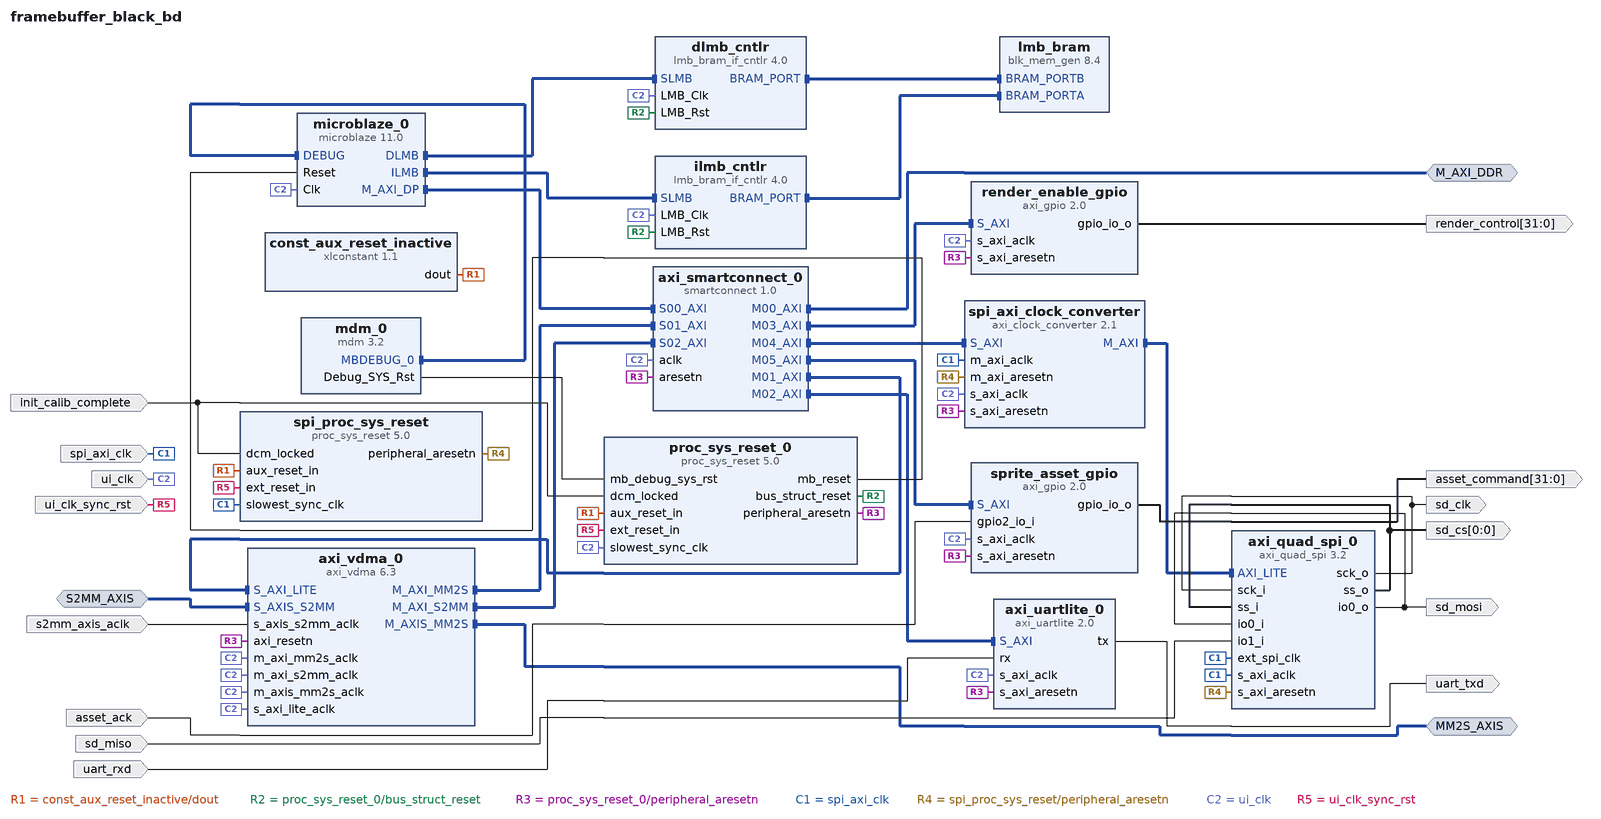
[diagram p0: block diagram of the top level]
# Vivado block design framebuffer_black_bd, xc7a100tfgg484-2, Vivado 2025.2
create_bd_design framebuffer_black_bd

create_bd_intf_port -mode Master -vlnv xilinx.com:interface:aximm_rtl:1.0 M_AXI_DDR
set_property -dict [list \
  CONFIG.ADDR_WIDTH 32 \
  CONFIG.DATA_WIDTH 256 \
  CONFIG.NUM_READ_OUTSTANDING 8 \
  CONFIG.NUM_WRITE_OUTSTANDING 8 \
  CONFIG.PROTOCOL AXI4 \
] [get_bd_intf_ports M_AXI_DDR]
create_bd_intf_port -mode Master -vlnv xilinx.com:interface:axis_rtl:1.0 MM2S_AXIS
create_bd_intf_port -mode Slave -vlnv xilinx.com:interface:axis_rtl:1.0 S2MM_AXIS
set_property -dict [list \
  CONFIG.FREQ_HZ 74250000 \
  CONFIG.HAS_TKEEP 1 \
  CONFIG.HAS_TLAST 1 \
  CONFIG.HAS_TREADY 1 \
  CONFIG.HAS_TSTRB 0 \
  CONFIG.LAYERED_METADATA undef \
  CONFIG.TDATA_NUM_BYTES 2 \
  CONFIG.TDEST_WIDTH 0 \
  CONFIG.TID_WIDTH 0 \
  CONFIG.TUSER_WIDTH 1 \
] [get_bd_intf_ports S2MM_AXIS]
create_bd_port -dir I -type clk ui_clk
set_property -dict {CONFIG.FREQ_HZ 100000000} [get_bd_ports ui_clk]
create_bd_port -dir I -type clk spi_axi_clk
set_property -dict {CONFIG.FREQ_HZ 6250000} [get_bd_ports spi_axi_clk]
create_bd_port -dir I -type rst ui_clk_sync_rst
set_property -dict {CONFIG.POLARITY ACTIVE_HIGH} [get_bd_ports ui_clk_sync_rst]
create_bd_port -dir I init_calib_complete
create_bd_port -dir I -type clk s2mm_axis_aclk
set_property -dict {CONFIG.ASSOCIATED_BUSIF S2MM_AXIS CONFIG.FREQ_HZ 74250000} [get_bd_ports s2mm_axis_aclk]
create_bd_port -dir I uart_rxd
create_bd_port -dir O uart_txd
create_bd_port -dir I sd_miso
create_bd_port -dir O sd_mosi
create_bd_port -dir O sd_clk
create_bd_port -dir O -from 0 -to 0 sd_cs
create_bd_port -dir O -from 31 -to 0 render_control
create_bd_port -dir O -from 31 -to 0 asset_command
create_bd_port -dir I asset_ack

create_bd_cell -type ip -vlnv xilinx.com:ip:microblaze:11.0 microblaze_0
set_property -dict [list \
  CONFIG.C_AREA_OPTIMIZED 1 \
  CONFIG.C_DEBUG_ENABLED 1 \
  CONFIG.C_D_AXI 1 \
  CONFIG.C_D_LMB 1 \
  CONFIG.C_I_LMB 1 \
  CONFIG.C_USE_BARREL 1 \
  CONFIG.C_USE_HW_MUL 1 \
] [get_bd_cells microblaze_0]
create_bd_cell -type ip -vlnv xilinx.com:ip:lmb_bram_if_cntlr:4.0 ilmb_cntlr
create_bd_cell -type ip -vlnv xilinx.com:ip:lmb_bram_if_cntlr:4.0 dlmb_cntlr
create_bd_cell -type ip -vlnv xilinx.com:ip:blk_mem_gen:8.4 lmb_bram
set_property -dict [list \
  CONFIG.Enable_B Use_ENB_Pin \
  CONFIG.Memory_Type True_Dual_Port_RAM \
  CONFIG.Read_Width_A 32 \
  CONFIG.Read_Width_B 32 \
  CONFIG.Use_RSTA_Pin true \
  CONFIG.Use_RSTB_Pin true \
  CONFIG.Write_Width_A 32 \
  CONFIG.Write_Width_B 32 \
] [get_bd_cells lmb_bram]
create_bd_cell -type ip -vlnv xilinx.com:ip:mdm:3.2 mdm_0
set_property -dict {CONFIG.C_USE_UART 0} [get_bd_cells mdm_0]
create_bd_cell -type ip -vlnv xilinx.com:ip:proc_sys_reset:5.0 proc_sys_reset_0
create_bd_cell -type ip -vlnv xilinx.com:ip:xlconstant:1.1 const_aux_reset_inactive
set_property -dict {CONFIG.CONST_VAL 1} [get_bd_cells const_aux_reset_inactive]
create_bd_cell -type ip -vlnv xilinx.com:ip:axi_vdma:6.3 axi_vdma_0
set_property -dict [list \
  CONFIG.c_flush_on_fsync 0 \
  CONFIG.c_include_internal_genlock 1 \
  CONFIG.c_include_mm2s 1 \
  CONFIG.c_include_mm2s_dre 1 \
  CONFIG.c_include_s2mm 1 \
  CONFIG.c_include_s2mm_dre 1 \
  CONFIG.c_m_axi_mm2s_data_width 64 \
  CONFIG.c_m_axi_s2mm_data_width 64 \
  CONFIG.c_m_axis_mm2s_tdata_width 16 \
  CONFIG.c_mm2s_genlock_mode 3 \
  CONFIG.c_mm2s_linebuffer_depth 4096 \
  CONFIG.c_mm2s_max_burst_length 16 \
  CONFIG.c_num_fstores 3 \
  CONFIG.c_s2mm_genlock_mode 2 \
  CONFIG.c_s2mm_linebuffer_depth 4096 \
  CONFIG.c_s2mm_max_burst_length 16 \
  CONFIG.c_use_mm2s_fsync 0 \
  CONFIG.c_use_s2mm_fsync 0 \
] [get_bd_cells axi_vdma_0]
create_bd_cell -type ip -vlnv xilinx.com:ip:axi_uartlite:2.0 axi_uartlite_0
set_property -dict {CONFIG.C_BAUDRATE 115200 CONFIG.C_DATA_BITS 8 CONFIG.C_USE_PARITY 0} [get_bd_cells axi_uartlite_0]
create_bd_cell -type ip -vlnv xilinx.com:ip:axi_quad_spi:3.2 axi_quad_spi_0
set_property -dict [list \
  CONFIG.C_FIFO_DEPTH 16 \
  CONFIG.C_NUM_SS_BITS 1 \
  CONFIG.C_NUM_TRANSFER_BITS 8 \
  CONFIG.C_SCK_RATIO 16 \
  CONFIG.C_SPI_MODE 0 \
  CONFIG.C_TYPE_OF_AXI4_INTERFACE 0 \
  CONFIG.C_USE_STARTUP 0 \
  CONFIG.Master_mode 1 \
] [get_bd_cells axi_quad_spi_0]
create_bd_cell -type ip -vlnv xilinx.com:ip:axi_clock_converter:2.1 spi_axi_clock_converter
create_bd_cell -type ip -vlnv xilinx.com:ip:proc_sys_reset:5.0 spi_proc_sys_reset
create_bd_cell -type ip -vlnv xilinx.com:ip:axi_gpio:2.0 render_enable_gpio
set_property -dict [list \
  CONFIG.C_ALL_OUTPUTS 1 \
  CONFIG.C_DOUT_DEFAULT 0x00000000 \
  CONFIG.C_GPIO_WIDTH 32 \
] [get_bd_cells render_enable_gpio]
create_bd_cell -type ip -vlnv xilinx.com:ip:axi_gpio:2.0 sprite_asset_gpio
set_property -dict [list \
  CONFIG.C_ALL_INPUTS_2 1 \
  CONFIG.C_ALL_OUTPUTS 1 \
  CONFIG.C_DOUT_DEFAULT 0x00000000 \
  CONFIG.C_GPIO2_WIDTH 1 \
  CONFIG.C_GPIO_WIDTH 32 \
  CONFIG.C_IS_DUAL 1 \
] [get_bd_cells sprite_asset_gpio]
create_bd_cell -type ip -vlnv xilinx.com:ip:smartconnect:1.0 axi_smartconnect_0
set_property -dict {CONFIG.NUM_MI 6 CONFIG.NUM_SI 3} [get_bd_cells axi_smartconnect_0]

# ---- connections ----

connect_bd_intf_net [get_bd_intf_ports S2MM_AXIS] [get_bd_intf_pins axi_vdma_0/S_AXIS_S2MM]
connect_bd_intf_net [get_bd_intf_pins axi_smartconnect_0/M00_AXI] [get_bd_intf_ports M_AXI_DDR]
connect_bd_intf_net [get_bd_intf_pins axi_smartconnect_0/M01_AXI] [get_bd_intf_pins axi_vdma_0/S_AXI_LITE]
connect_bd_intf_net [get_bd_intf_pins axi_smartconnect_0/M02_AXI] [get_bd_intf_pins axi_uartlite_0/S_AXI]
connect_bd_intf_net [get_bd_intf_pins axi_smartconnect_0/M03_AXI] [get_bd_intf_pins render_enable_gpio/S_AXI]
connect_bd_intf_net [get_bd_intf_pins axi_smartconnect_0/M04_AXI] [get_bd_intf_pins spi_axi_clock_converter/S_AXI]
connect_bd_intf_net [get_bd_intf_pins axi_smartconnect_0/M05_AXI] [get_bd_intf_pins sprite_asset_gpio/S_AXI]
connect_bd_intf_net [get_bd_intf_pins axi_vdma_0/M_AXIS_MM2S] [get_bd_intf_ports MM2S_AXIS]
connect_bd_intf_net [get_bd_intf_pins axi_vdma_0/M_AXI_MM2S] [get_bd_intf_pins axi_smartconnect_0/S01_AXI]
connect_bd_intf_net [get_bd_intf_pins axi_vdma_0/M_AXI_S2MM] [get_bd_intf_pins axi_smartconnect_0/S02_AXI]
connect_bd_intf_net [get_bd_intf_pins dlmb_cntlr/BRAM_PORT] [get_bd_intf_pins lmb_bram/BRAM_PORTB]
connect_bd_intf_net [get_bd_intf_pins ilmb_cntlr/BRAM_PORT] [get_bd_intf_pins lmb_bram/BRAM_PORTA]
connect_bd_intf_net [get_bd_intf_pins microblaze_0/DEBUG] [get_bd_intf_pins mdm_0/MBDEBUG_0]
connect_bd_intf_net [get_bd_intf_pins microblaze_0/DLMB] [get_bd_intf_pins dlmb_cntlr/SLMB]
connect_bd_intf_net [get_bd_intf_pins microblaze_0/ILMB] [get_bd_intf_pins ilmb_cntlr/SLMB]
connect_bd_intf_net [get_bd_intf_pins microblaze_0/M_AXI_DP] [get_bd_intf_pins axi_smartconnect_0/S00_AXI]
connect_bd_intf_net [get_bd_intf_pins spi_axi_clock_converter/M_AXI] [get_bd_intf_pins axi_quad_spi_0/AXI_LITE]
connect_bd_net [get_bd_ports asset_ack] [get_bd_pins sprite_asset_gpio/gpio2_io_i]
connect_bd_net [get_bd_pins axi_quad_spi_0/io0_o] [get_bd_ports sd_mosi] [get_bd_pins axi_quad_spi_0/io0_i]
connect_bd_net [get_bd_pins axi_quad_spi_0/sck_o] [get_bd_ports sd_clk] [get_bd_pins axi_quad_spi_0/sck_i]
connect_bd_net [get_bd_pins axi_quad_spi_0/ss_o] [get_bd_ports sd_cs] [get_bd_pins axi_quad_spi_0/ss_i]
connect_bd_net [get_bd_pins axi_uartlite_0/tx] [get_bd_ports uart_txd]
connect_bd_net [get_bd_pins const_aux_reset_inactive/dout] [get_bd_pins proc_sys_reset_0/aux_reset_in] [get_bd_pins spi_proc_sys_reset/aux_reset_in]
connect_bd_net [get_bd_ports init_calib_complete] [get_bd_pins proc_sys_reset_0/dcm_locked] [get_bd_pins spi_proc_sys_reset/dcm_locked]
connect_bd_net [get_bd_pins mdm_0/Debug_SYS_Rst] [get_bd_pins proc_sys_reset_0/mb_debug_sys_rst]
connect_bd_net [get_bd_pins proc_sys_reset_0/bus_struct_reset] [get_bd_pins ilmb_cntlr/LMB_Rst] [get_bd_pins dlmb_cntlr/LMB_Rst]
connect_bd_net [get_bd_pins proc_sys_reset_0/mb_reset] [get_bd_pins microblaze_0/Reset]
connect_bd_net [get_bd_pins proc_sys_reset_0/peripheral_aresetn] \
  [get_bd_pins axi_vdma_0/axi_resetn] [get_bd_pins axi_uartlite_0/s_axi_aresetn] \
  [get_bd_pins render_enable_gpio/s_axi_aresetn] [get_bd_pins sprite_asset_gpio/s_axi_aresetn] \
  [get_bd_pins spi_axi_clock_converter/s_axi_aresetn] [get_bd_pins axi_smartconnect_0/aresetn]
connect_bd_net [get_bd_pins render_enable_gpio/gpio_io_o] [get_bd_ports render_control]
connect_bd_net [get_bd_ports s2mm_axis_aclk] [get_bd_pins axi_vdma_0/s_axis_s2mm_aclk]
connect_bd_net [get_bd_ports sd_miso] [get_bd_pins axi_quad_spi_0/io1_i]
connect_bd_net [get_bd_ports spi_axi_clk] \
  [get_bd_pins spi_proc_sys_reset/slowest_sync_clk] [get_bd_pins axi_quad_spi_0/s_axi_aclk] \
  [get_bd_pins axi_quad_spi_0/ext_spi_clk] [get_bd_pins spi_axi_clock_converter/m_axi_aclk]
connect_bd_net [get_bd_pins spi_proc_sys_reset/peripheral_aresetn] \
  [get_bd_pins axi_quad_spi_0/s_axi_aresetn] [get_bd_pins spi_axi_clock_converter/m_axi_aresetn]
connect_bd_net [get_bd_pins sprite_asset_gpio/gpio_io_o] [get_bd_ports asset_command]
connect_bd_net [get_bd_ports uart_rxd] [get_bd_pins axi_uartlite_0/rx]
connect_bd_net [get_bd_ports ui_clk] \
  [get_bd_pins proc_sys_reset_0/slowest_sync_clk] [get_bd_pins microblaze_0/Clk] [get_bd_pins ilmb_cntlr/LMB_Clk] \
  [get_bd_pins dlmb_cntlr/LMB_Clk] [get_bd_pins axi_vdma_0/s_axi_lite_aclk] [get_bd_pins axi_vdma_0/m_axi_mm2s_aclk] \
  [get_bd_pins axi_vdma_0/m_axis_mm2s_aclk] [get_bd_pins axi_vdma_0/m_axi_s2mm_aclk] [get_bd_pins axi_uartlite_0/s_axi_aclk] \
  [get_bd_pins render_enable_gpio/s_axi_aclk] [get_bd_pins sprite_asset_gpio/s_axi_aclk] \
  [get_bd_pins axi_smartconnect_0/aclk] [get_bd_pins spi_axi_clock_converter/s_axi_aclk]
connect_bd_net [get_bd_ports ui_clk_sync_rst] [get_bd_pins proc_sys_reset_0/ext_reset_in] [get_bd_pins spi_proc_sys_reset/ext_reset_in]
set_property HDL_ATTRIBUTE.BMM_INFO_PROCESSOR {microblaze-le > framebuffer_black_bd dlmb_cntlr} [get_bd_cells microblaze_0]
set_property HDL_ATTRIBUTE.KEEP_HIERARCHY yes [get_bd_cells microblaze_0]
set_property HDL_ATTRIBUTE.BMM_INFO_ADDRESS_SPACE {byte  0x00000000 32 > framebuffer_black_bd lmb_bram} [get_bd_cells dlmb_cntlr]
set_property HDL_ATTRIBUTE.KEEP_HIERARCHY yes [get_bd_cells dlmb_cntlr]

# ---- address map ----
assign_bd_address -offset 0x80000000 -range 512M -target_address_space [get_bd_addr_spaces axi_vdma_0/Data_MM2S] [get_bd_addr_segs M_AXI_DDR/Reg]
exclude_bd_addr_seg -offset 0x00000000 -range 1 -target_address_space [get_bd_addr_spaces axi_vdma_0/Data_MM2S] [get_bd_addr_segs axi_quad_spi_0/AXI_LITE/Reg]
exclude_bd_addr_seg -offset 0x00000000 -range 1 -target_address_space [get_bd_addr_spaces axi_vdma_0/Data_MM2S] [get_bd_addr_segs axi_uartlite_0/S_AXI/Reg]
exclude_bd_addr_seg -offset 0x00000000 -range 1 -target_address_space [get_bd_addr_spaces axi_vdma_0/Data_MM2S] [get_bd_addr_segs axi_vdma_0/S_AXI_LITE/Reg]
exclude_bd_addr_seg -offset 0x00000000 -range 1 -target_address_space [get_bd_addr_spaces axi_vdma_0/Data_MM2S] [get_bd_addr_segs render_enable_gpio/S_AXI/Reg]
exclude_bd_addr_seg -offset 0x00000000 -range 1 -target_address_space [get_bd_addr_spaces axi_vdma_0/Data_MM2S] [get_bd_addr_segs sprite_asset_gpio/S_AXI/Reg]
assign_bd_address -offset 0x80000000 -range 512M -target_address_space [get_bd_addr_spaces axi_vdma_0/Data_S2MM] [get_bd_addr_segs M_AXI_DDR/Reg]
exclude_bd_addr_seg -offset 0x00000000 -range 1 -target_address_space [get_bd_addr_spaces axi_vdma_0/Data_S2MM] [get_bd_addr_segs axi_quad_spi_0/AXI_LITE/Reg]
exclude_bd_addr_seg -offset 0x00000000 -range 1 -target_address_space [get_bd_addr_spaces axi_vdma_0/Data_S2MM] [get_bd_addr_segs axi_uartlite_0/S_AXI/Reg]
exclude_bd_addr_seg -offset 0x00000000 -range 1 -target_address_space [get_bd_addr_spaces axi_vdma_0/Data_S2MM] [get_bd_addr_segs axi_vdma_0/S_AXI_LITE/Reg]
exclude_bd_addr_seg -offset 0x00000000 -range 1 -target_address_space [get_bd_addr_spaces axi_vdma_0/Data_S2MM] [get_bd_addr_segs render_enable_gpio/S_AXI/Reg]
exclude_bd_addr_seg -offset 0x00000000 -range 1 -target_address_space [get_bd_addr_spaces axi_vdma_0/Data_S2MM] [get_bd_addr_segs sprite_asset_gpio/S_AXI/Reg]
assign_bd_address -offset 0x00000000 -range 128K -target_address_space [get_bd_addr_spaces microblaze_0/Data] [get_bd_addr_segs dlmb_cntlr/SLMB/Mem]
assign_bd_address -offset 0x40600000 -range 64K -target_address_space [get_bd_addr_spaces microblaze_0/Data] [get_bd_addr_segs axi_uartlite_0/S_AXI/Reg]
assign_bd_address -offset 0x41200000 -range 64K -target_address_space [get_bd_addr_spaces microblaze_0/Data] [get_bd_addr_segs render_enable_gpio/S_AXI/Reg]
assign_bd_address -offset 0x41210000 -range 64K -target_address_space [get_bd_addr_spaces microblaze_0/Data] [get_bd_addr_segs sprite_asset_gpio/S_AXI/Reg]
assign_bd_address -offset 0x44A00000 -range 64K -target_address_space [get_bd_addr_spaces microblaze_0/Data] [get_bd_addr_segs axi_vdma_0/S_AXI_LITE/Reg]
assign_bd_address -offset 0x44A10000 -range 64K -target_address_space [get_bd_addr_spaces microblaze_0/Data] [get_bd_addr_segs axi_quad_spi_0/AXI_LITE/Reg]
assign_bd_address -offset 0x80000000 -range 512M -target_address_space [get_bd_addr_spaces microblaze_0/Data] [get_bd_addr_segs M_AXI_DDR/Reg]
assign_bd_address -offset 0x00000000 -range 128K -target_address_space [get_bd_addr_spaces microblaze_0/Instruction] [get_bd_addr_segs ilmb_cntlr/SLMB/Mem]

validate_bd_design
save_bd_design
